# EAGLE schematic touch-sensor (EAGLE 9.6.2)
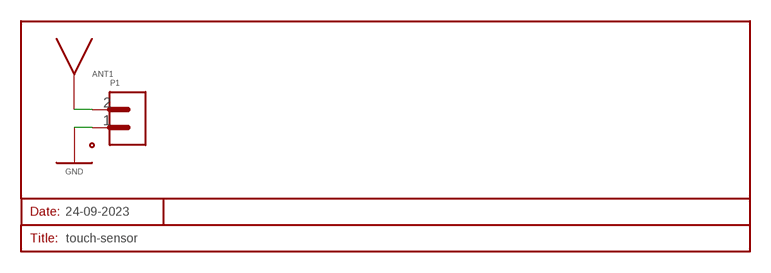
[diagram p0: schematic, sheet 1]

## Parts
P1  PORT_2-PIN_XH2.54  [XH2.54_2-PIN]
SCHEMATIC1  24-09-2023  SHEET  [SHEET]

## Nets
ANT: P1.2
GND: P1.1

## Library data of the parts
P1 = myLibrary:PORT_2-PIN
SCHEMATIC1 = myLibrary:SHEET